# Altium schematic sheet 02_Power.SchDoc: OpenCamera Slider - Power
size A4; SheetNumber: 2; SheetTotal: 4; Distributor: DigiKey
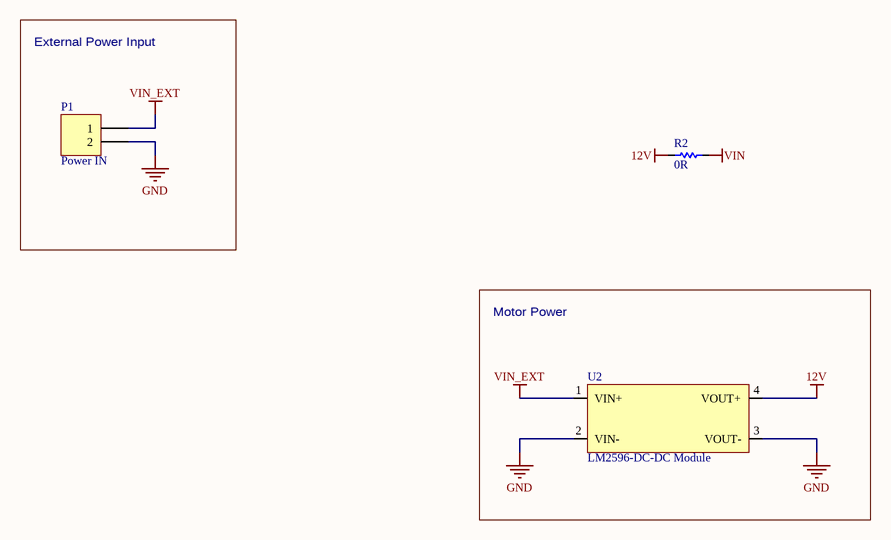
[diagram p0: 02_Power.SchDoc]

## Parts
P1  Power IN  [TERMINAL_2POS_90DEG_2PART]
R2  value 0R  [0603]  (hidden comment: Res)
U2  LM2596-DC-DC Module  [LM2596-DC-DC Module]

## Blocks framed on the sheet
External Power Input: P1
Motor Power: U2

## Nets
12V: R2.2 U2.4(VOUT+)
GND: P1.2 U2.2(VIN-) U2.3(VOUT-)
VIN: R2.1
VIN_EXT: P1.1 U2.1(VIN+)

## Notes on the sheet
- sasakaranovic.com/youtube
- sasakaranovic.com
- sasakaranovic.com/github
- sasakaranovic.com/facebook
- sasakaranovic.com/twitter
- sasakaranovic.com/linkedin

## Library data of the parts
P1 = Terminal 2_691322110002: 2 Position Terminal Block Header, Male Pins, Shrouded (4 Side) 0.138" (3.50mm) 90°, Right Angle - Through Hole; Manufacturer: Würth Elektronik; Manufacturer Part Number: 691322110002; Distributor: DigiKey; Distributor Part Number: 732-2769-ND
R2 = Res: Resistor; Manufacturer: YAGEO; Manufacturer Part Number: RC0603FR-130RL; Distributor: DigiKey; Distributor Part Number: 13-RC0603FR-130RLCT-ND
U2 = LM2596-DC-DC Module: LM2596-DC-DC Module HW-411; Distributor: AliExpress; Distributor Part Number: https://www.aliexpress.com/item/33004374185.html; Manufacturer Part Number: LM2596-DC-DC; URL: https://www.aliexpress.com/item/33004374185.html